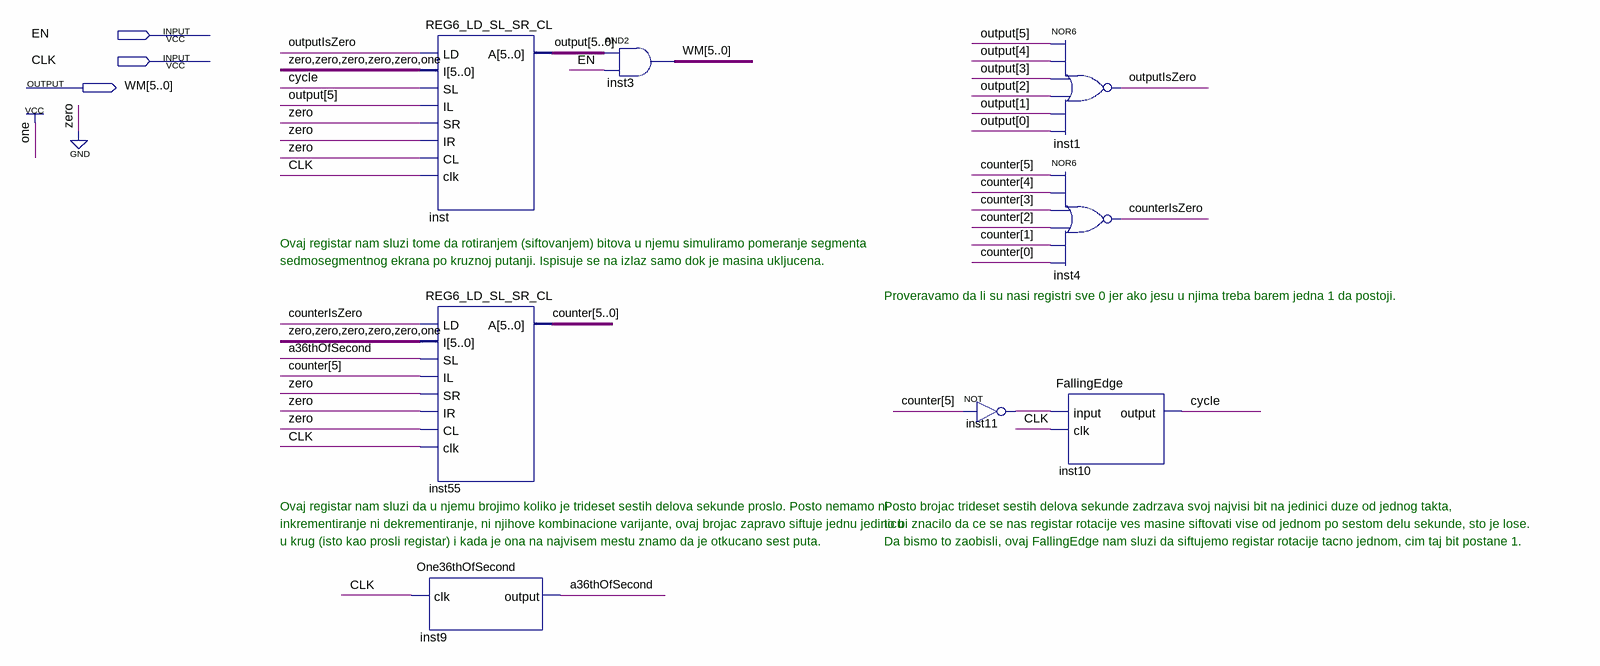
[diagram p0: schematic sheet]
// Quartus schematic zadatak3.bdf as structural Verilog: 8 symbols, 3 pins
module zadatak3 (
  input  EN,
  input  CLK,
  output [5:0] WM
);

  wire a36thOfSecond, counterIsZero, cycle, inst11_out, outputIsZero;
  wire [5:0] counter, \output ;

  REG6_LD_SL_SR_CL inst (
    .LD(outputIsZero), .I(6'b000001), .SL(cycle), .IL(\output [5]), .SR(1'b0), .IR(1'b0), .CL(1'b0),
    .clk(CLK), .A(\output ));
  REG6_LD_SL_SR_CL inst55 (
    .LD(counterIsZero), .I(6'b000001), .SL(a36thOfSecond), .IL(counter[5]), .SR(1'b0), .IR(1'b0), .CL(1'b0),
    .clk(CLK), .A(counter));
  One36thOfSecond inst9 (.clk(CLK), .\output (a36thOfSecond));
  assign WM = \output  & {6{EN}};  // AND2 inst3, 6 bits wide
  not inst11 (inst11_out, counter[5]);
  nor inst1 (outputIsZero, \output [5], \output [4], \output [3], \output [2], \output [1], \output [0]);
  nor inst4 (counterIsZero, counter[5], counter[4], counter[3], counter[2], counter[1], counter[0]);
  FallingEdge inst10 (.\input (inst11_out), .clk(CLK), .\output (cycle));

  // Notes on the sheet:
  //   Ovaj registar nam sluzi tome da rotiranjem (siftovanjem) bitova u njemu simuliramo pomeranje segmenta
  //   sedmosegmentnog ekrana po kruznoj putanji. Ispisuje se na izlaz samo dok je masina ukljucena.
  //   Proveravamo da li su nasi registri sve 0 jer ako jesu u njima treba barem jedna 1 da postoji.
  //   Ovaj registar nam sluzi da u njemu brojimo koliko je trideset sestih delova sekunde proslo. Posto nemamo ni
  //   Posto brojac trideset sestih delova sekunde zadrzava svoj najvisi bit na jedinici duze od jednog takta,
  //   inkrementiranje ni dekrementiranje, ni njihove kombinacione varijante, ovaj brojac zapravo siftuje jednu jedinicu
  //   to bi znacilo da ce se nas registar rotacije ves masine siftovati vise od jednom po sestom delu sekunde, sto je lose.
  //   u krug (isto kao prosli registar) i kada je ona na najvisem mestu znamo da je otkucano sest puta.
  //   Da bismo to zaobisli, ovaj FallingEdge nam sluzi da siftujemo registar rotacije tacno jednom, cim taj bit postane 1.
endmodule
